# EAGLE design schema (EAGLE 9.5.2)
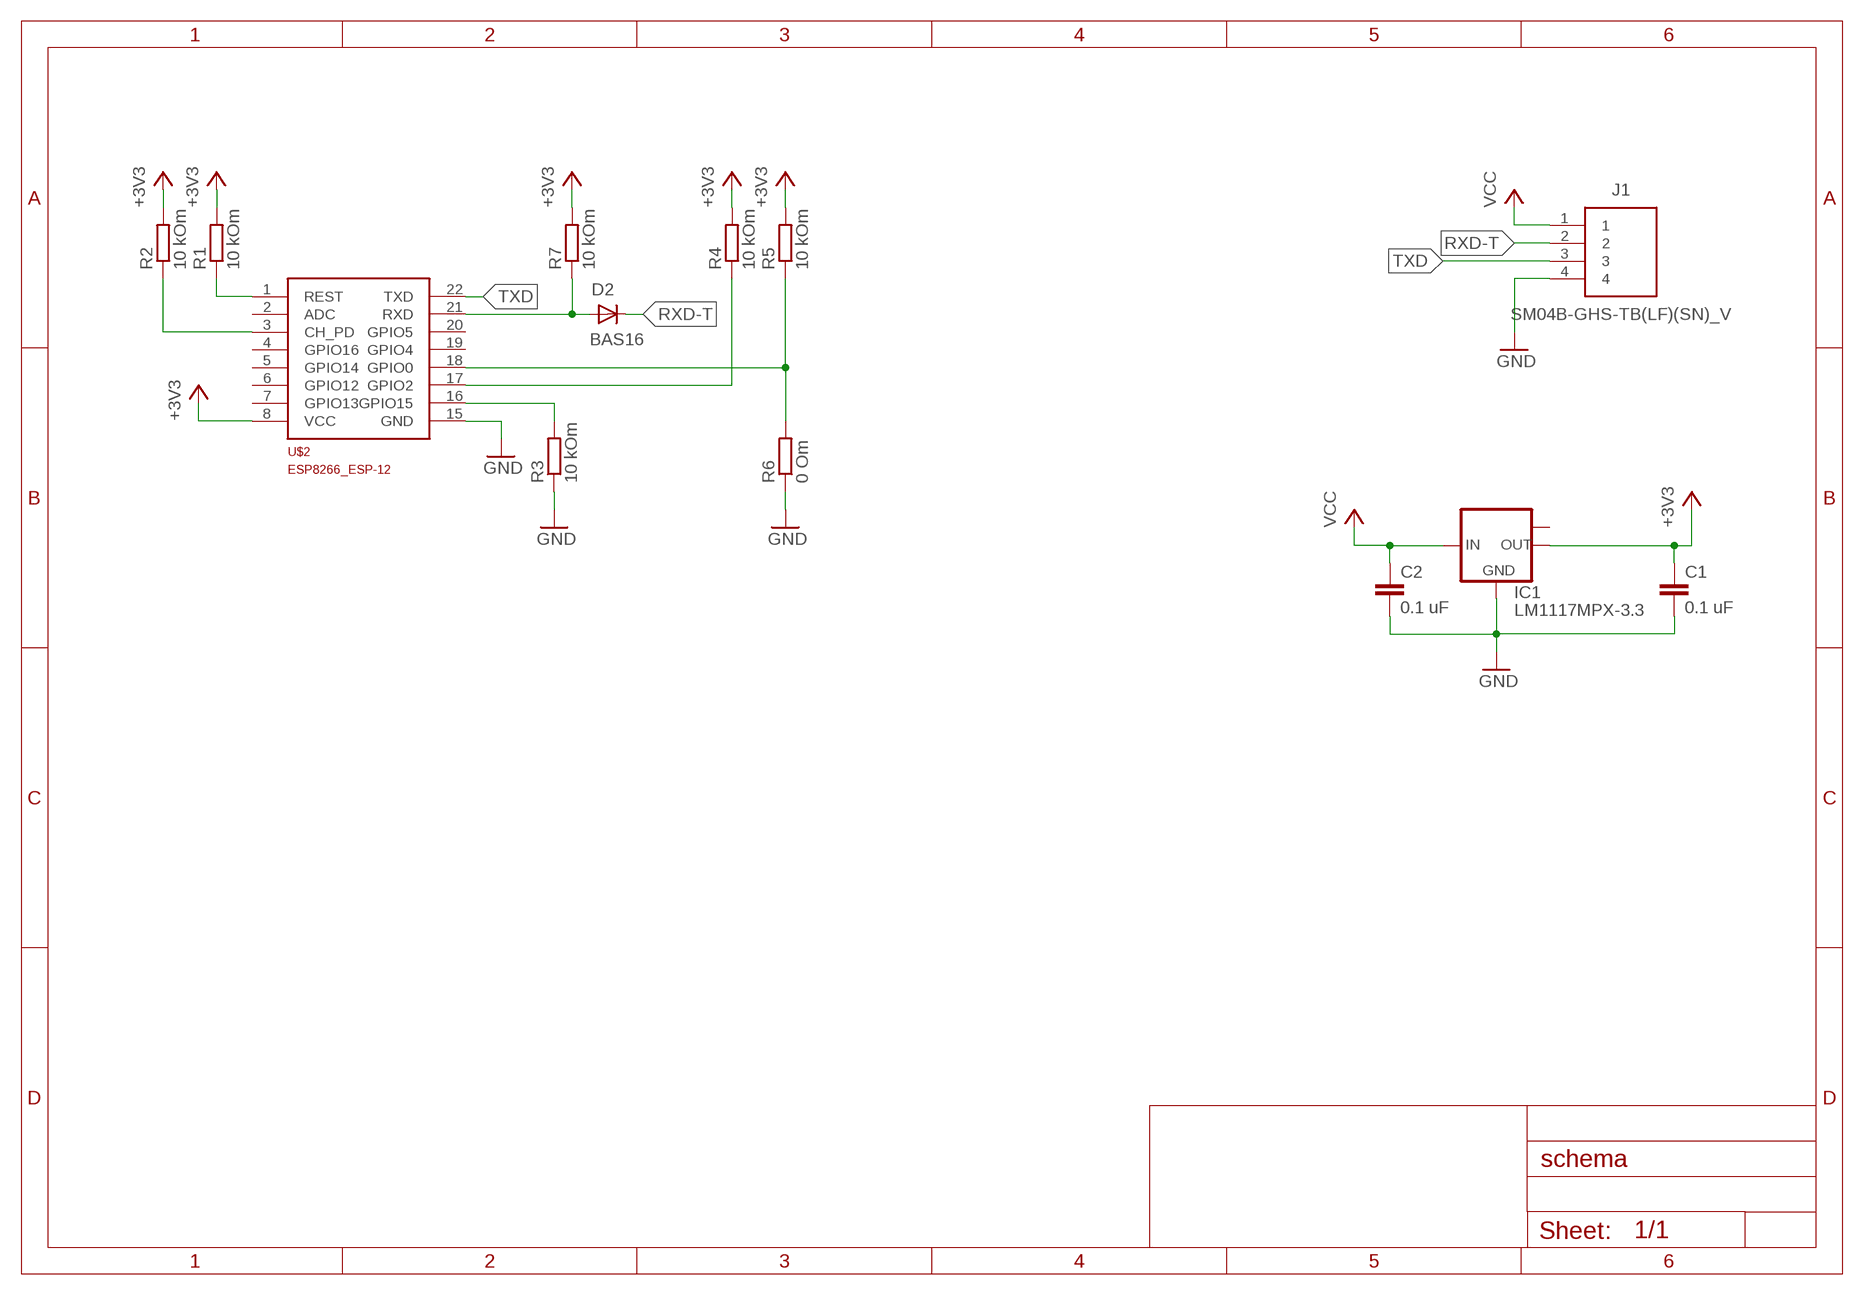
[diagram p0: schematic, sheet 1]

## Parts
C1  0.1 uF  C-EUC0603  [C0603]
C2  0.1 uF  C-EUC0603  [C0603]
D2  BAS16  [SOT23]
IC1  LM1117MPX-3.3  [SOT223]
J1  SM04B-GHS-TB(LF)(SN)_V  [SM04B-GHS-TB]
R1  10 kOm  R-EU_R0603  [R0603]
R2  10 kOm  R-EU_R0603  [R0603]
R3  10 kOm  R-EU_R0603  [R0603]
R4  10 kOm  R-EU_R0603  [R0603]
R5  10 kOm  R-EU_R0603  [R0603]
R6  0 Om  R-EU_R0603  [R0603]
R7  10 kOm  R-EU_R0603  [R0603]
U$2  ESP8266_ESP-12F  [ESP8266-ESP12]

## Nets
+3V3: C1.1 IC1.2(OUT) R1.2 R2.2 R4.2 R5.2 R7.2 U$2.8(VCC)
GND: C1.2 C2.2 IC1.1(GND) J1.4 R3.1 R6.1 U$2.15(GND)
N$1: R1.1 U$2.1(REST)
N$2: R2.1 U$2.3(CH_PD)
N$3: R3.2 U$2.16(GPIO15)
N$4: R4.1 U$2.17(GPIO2)
N$5: R5.1 R6.2 U$2.18(GPIO0)
RXD: D2.1(A) R7.1 U$2.21(RXD)
RXD-T: D2.3(K) J1.2
TXD: J1.3 U$2.22(TXD)
VCC: C2.1 IC1.3(IN) J1.1
Unconnected: IC1.TAB(OUT1) U$2.2(ADC) U$2.4(GPIO16) U$2.5(GPIO14) U$2.6(GPIO12) U$2.7(GPIO13) U$2.19(GPIO4) U$2.20(GPIO5)

## Library data of the parts
C1 C2 = rcl:C-EU: CAPACITOR, European symbol; SPICEPREFIX: C
D2 = nxp_60:BAS16: High-speed switching diode High-speed switching diode, encapsulated in small Surface-Mounted Device (SMD) plastic packages. AAL Eindhoven MK
IC1 = Texas Instruments:LM1117MPX-*
J1 = SM04B-GHS-TB(LF)(SN):SM04B-GHS-TB(LF)(SN)_V: JST GH Series, 1.25mm Pitch 4 Way Right Angle PCB Header, Solder Termination, 1A <https://componentsearchengine.com/Images/3/SM04B-GHS-TB%28LF%29%28SN%29.jpg> Source: Datasheet <http://uk.rs-online.com/web/p/products/7521797>; DESCRIPTION: JST GH Series, 1.25mm Pitch 4 Way Right Angle PCB Header, Solder Termination, 1A; HEIGHT: mm; MANUFACTURER_NAME: JST (JAPAN SOLDERLESS TERMINALS); MANUFACTURER_PART_NUMBER: SM04B-GHS-TB(LF)(SN); RS_PART_NUMBER: 7521797; SUPPLIER_NAME: RS
R1-R7 = rcl:R-EU_: RESISTOR, European symbol; SPICEPREFIX: R
U$2 = ESP8266:ESP8266_ESP-12F: Datasheet <https://www.elecrow.com/download/ESP-12F.pdf>

## Board
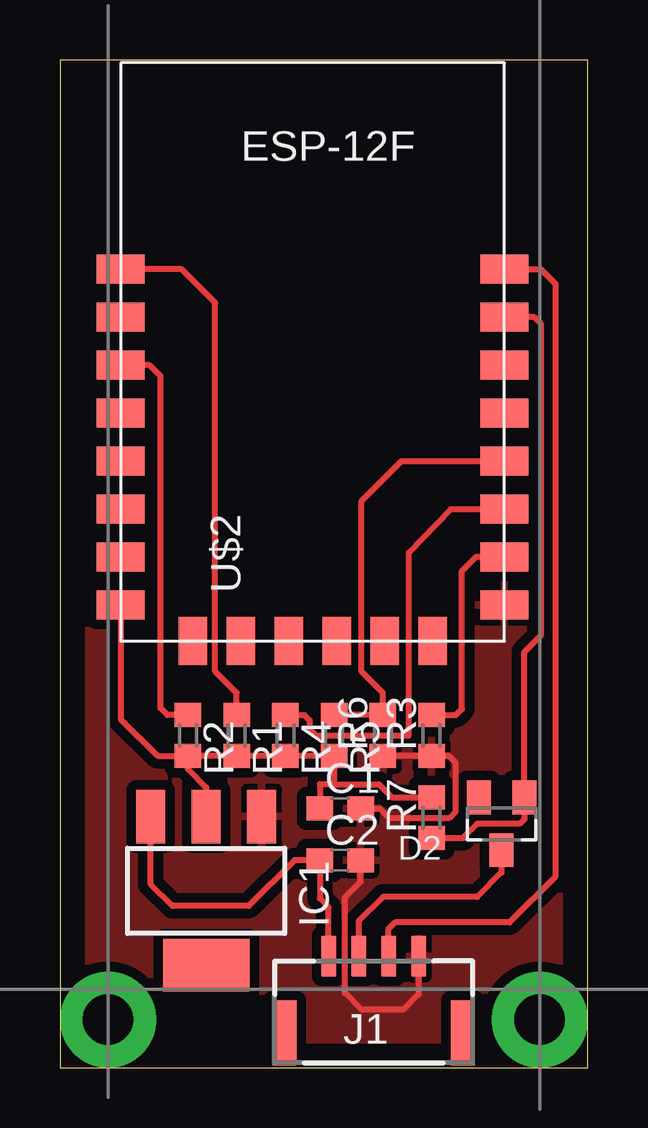
[diagram p1: board, top side]

Size 22 x 42 mm. Coordinates in mm from the lower left corner, seen from the top.
Outline: 0,0 22,0 22,42 0,42 0,0
Copper layers (1*16): Top 0.035mm / dielectric 1.5mm / Bottom 0.035mm
Design rules "default": minimum track width 6mil, minimum drill 0.35mm, track to track 6mil, track to pad 6mil, pad to pad 6mil, via to via 6mil, smd to smd 6mil, copper to edge 40mil, drill to drill 6mil, minimum pad ring 10mil, minimum via ring 8mil, stop-mask expansion 4mil, vias tented up to drill 0mil, thermal gap 10mil

### Footprints (pad centres in the part's own frame; a part is rotated, then mirrored left to right if it is on the bottom)
C0603 = smd 1.1 x 1: 1 -0.85,0; 2 0.85,0
SOT23 = smd 1 x 1.4: 1 -0.95,-1.1; 2 0.95,-1.1; 3 0,1.1
SOT223 = smd 1.219 x 2.235: 1 -2.311,-3.099; 2 0,-3.099; 3 2.311,-3.099 | smd 3.6 x 2.2: TAB 0,3.099
SM04B-GHS-TB = smd 0.6 x 1.7: 1 -1.875,0.2; 2 -0.625,0.2; 3 0.625,0.2; 4 1.875,0.2 | smd 1 x 2.7: 5 -3.725,-3; 6 3.725,-3
R0603 = smd 1 x 1.1: 1 -0.85,0; 2 0.85,0
ESP8266-ESP12 = smd 2 x 1.2: 1 0,15.5; 2 0,13.5; 3 0,11.5; 4 0,9.5; 5 0,7.5; 6 0,5.5; 7 0,3.5; 8 0,1.5; 15 16,1.5; 16 16,3.5; 17 16,5.5; 18 16,7.5; 19 16,9.5; 20 16,11.5; 21 16,13.5; 22 16,15.5 | smd 1.2 x 2: 9 3,0; 10 5,0; 11 7,0; 12 9,0; 13 11,0; 14 13,0

### Placement (x,y rotation side)
C1  11.68,10.79 0 top
C2  11.68,8.64 0 top
D2  18.41,10.16 180 top
IC1  6.1,7.37 180 top
J1  13.08,4.45 0 top
R1  7.37,13.84 270 top
R2  5.34,13.84 270 top
R3  15.49,13.84 90 top
R4  9.4,13.84 270 top
R5  11.43,13.84 270 top
R6  13.46,13.84 90 top
R7  15.49,10.41 90 top
U$2  2.54,17.78 0 top

### Tracks (layer width: path | path; a pad name or v marks a point on that pad's centre or on a via)
+3V3
  Top 0.254: U$2.8 2.54,14.52 4.06,12.99 R2.2 | R2.2 R1.2 R4.2 R5.2 11.43,11.81 | R2.2 5.34,12.44 6.1,11.68 IC1.2 | C1.1 10.83,11.81 11.43,11.81 | R7.2 13.84,11.26 13.3,11.81 11.43,11.81
GND
  Top 0.254: R6.1 R3.1 16.22,12.99 16.51,12.7 16.51,10.67 16.26,10.41 13.72,10.41 13.34,10.79 C1.2 | J1.4 14.96,3.05 14.32,2.41 12.57,2.41 11.88,3.11 11.88,7.09 12.53,7.75 C2.2
  pour Top (isolate 0.406): 0,42 22,42 22,0 0,0
N$1
  Top 0.254: R1.1 7.37,15.62 6.48,16.51 6.48,31.88 5.07,33.28 U$2.1
N$2
  Top 0.254: U$2.3 3.74,29.28 4.19,28.83 4.19,14.99 4.48,14.69 R2.1
N$3
  Top 0.254: R3.2 16.51,14.69 16.76,14.95 16.76,20.7 17.34,21.28 U$2.16
N$4
  Top 0.254: R4.1 10.2,14.69 10.41,14.48 10.41,14.1 10.67,13.84 14.55,13.84 14.55,21.46 16.3,23.28 U$2.17
N$5
  Top 0.254: R5.1 R6.2 13.46,15.62 12.57,16.51 12.57,23.62 14.23,25.28 U$2.18
N$6  (via drill 2.1 pad 4)
  other vias: 20,2
N$7  (via drill 2.1 pad 4)
  other vias: 2,2
RXD
  Top 0.254: U$2.21 19.77,31.28 20.07,30.99 20.07,18.03 19.36,17.33 D2.1 19.36,10.35 19.18,10.16 17.4,10.16 16.8,9.56 R7.1
RXD-T
  Top 0.254: D2.3 18.41,8.13 17.4,7.11 13.46,7.11 12.46,6.11 J1.2
TXD
  Top 0.254: U$2.22 20.06,33.28 20.67,32.67 20.67,7.97 18.74,6.04 13.96,6.04 13.71,5.79 J1.3
VCC
  Top 0.254: IC1.3 3.79,7.64 4.7,6.73 7.87,6.73 9.78,8.64 C2.1 10.83,7.05 11.21,6.68 J1.1

### Text on the board
Top: MAVLink ESP R1.4